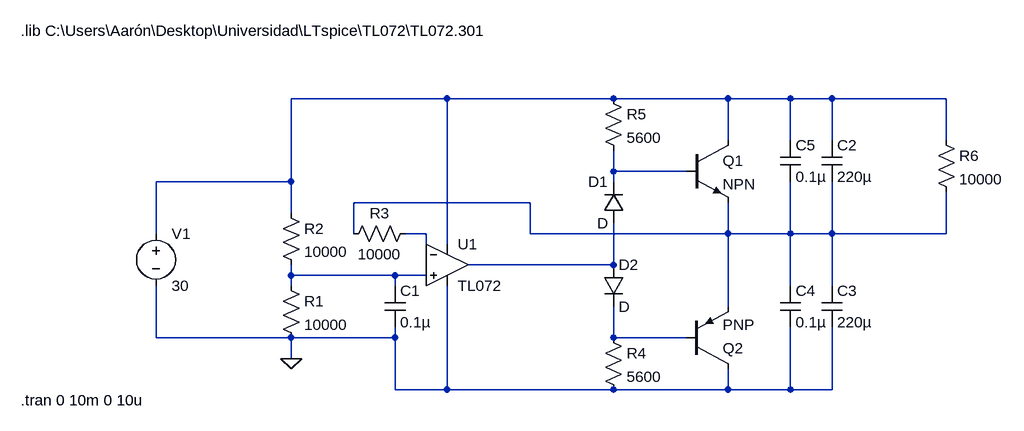
[diagram p0: schematic Symmetric_PowerSupply.asc]
Symmetric_PowerSupply.asc, the LTspice schematic file:
Version 4.1
SHEET 1 1524 680
WIRE 640 128 400 128
WIRE 896 128 640 128
WIRE 1072 128 896 128
WIRE 1168 128 1072 128
WIRE 1232 128 1168 128
WIRE 1408 128 1232 128
WIRE 1072 192 1072 128
WIRE 1168 192 1168 128
WIRE 1232 192 1232 128
WIRE 1408 192 1408 128
WIRE 896 240 896 208
WIRE 1008 240 896 240
WIRE 400 256 400 128
WIRE 400 256 192 256
WIRE 896 256 896 240
WIRE 768 288 496 288
WIRE 400 304 400 256
WIRE 192 336 192 256
WIRE 496 336 496 288
WIRE 608 336 576 336
WIRE 768 336 768 288
WIRE 1072 336 1072 288
WIRE 1072 336 768 336
WIRE 1168 336 1168 256
WIRE 1168 336 1072 336
WIRE 1232 336 1232 256
WIRE 1232 336 1168 336
WIRE 1408 336 1408 272
WIRE 1408 336 1232 336
WIRE 640 352 640 128
WIRE 608 368 608 336
WIRE 896 384 896 320
WIRE 896 384 672 384
WIRE 400 400 400 384
WIRE 560 400 400 400
WIRE 608 400 560 400
WIRE 400 416 400 400
WIRE 560 416 560 400
WIRE 1168 416 1168 336
WIRE 1232 416 1232 336
WIRE 1072 448 1072 336
WIRE 192 496 192 416
WIRE 400 496 192 496
WIRE 560 496 560 480
WIRE 560 496 400 496
WIRE 896 496 896 448
WIRE 1008 496 896 496
WIRE 400 528 400 496
WIRE 560 576 560 496
WIRE 640 576 640 416
WIRE 640 576 560 576
WIRE 896 576 640 576
WIRE 1072 576 1072 544
WIRE 1072 576 896 576
WIRE 1168 576 1168 480
WIRE 1168 576 1072 576
WIRE 1232 576 1232 480
WIRE 1232 576 1168 576
FLAG 400 528 0
SYMBOL OpAmps\\opamp2 640 320 R0
SYMATTR InstName U1
SYMATTR Value TL072
SYMBOL cap 544 416 R0
SYMATTR InstName C1
SYMATTR Value 0.1µ
SYMATTR SpiceLine V=35 Irms=0 Rser=0 Lser=0
SYMBOL res 384 400 R0
SYMATTR InstName R1
SYMATTR Value 10000
SYMBOL res 384 288 R0
SYMATTR InstName R2
SYMATTR Value 10000
SYMBOL voltage 192 320 R0
WINDOW 123 0 0 Left 0
WINDOW 39 0 0 Left 0
SYMATTR InstName V1
SYMATTR Value 30
SYMBOL res 592 320 R90
WINDOW 0 0 56 VBottom 2
WINDOW 3 32 56 VTop 2
SYMATTR InstName R3
SYMATTR Value 10000
SYMBOL diode 912 320 R180
WINDOW 0 24 64 Left 2
WINDOW 3 24 0 Left 2
SYMATTR InstName D1
SYMBOL diode 880 384 R0
SYMATTR InstName D2
SYMBOL res 880 480 R0
SYMATTR InstName R4
SYMATTR Value 5600
SYMBOL res 880 112 R0
SYMATTR InstName R5
SYMATTR Value 5600
SYMBOL npn 1008 192 R0
SYMATTR InstName Q1
SYMBOL pnp 1008 544 M180
SYMATTR InstName Q2
SYMBOL cap 1216 192 R0
SYMATTR InstName C2
SYMATTR Value 220µ
SYMATTR SpiceLine V=50
SYMBOL cap 1216 416 R0
SYMATTR InstName C3
SYMATTR Value 220µ
SYMATTR SpiceLine V=50
SYMBOL cap 1152 416 R0
SYMATTR InstName C4
SYMATTR Value 0.1µ
SYMATTR SpiceLine V=50
SYMBOL cap 1152 192 R0
SYMATTR InstName C5
SYMATTR Value 0.1µ
SYMATTR SpiceLine V=50
SYMBOL res 1392 176 R0
SYMATTR InstName R6
SYMATTR Value 10000
TEXT -16 24 Left 2 !.lib C:\\Users\\Aarón\\Desktop\\Universidad\\LTspice\\TL072\\TL072.301
TEXT -16 592 Left 2 !.tran 0 10m 0 10u

The netlist it stands for:
* Symmetric_PowerSupply.asc
X§U1 N006 N004 N001 0 N005 TL072  ; pins In+ In- V+ V- OUT
C1 N006 0 0.1µ V=35 Irms=0 Rser=0 Lser=0
R1 N006 0 10000
R2 N001 N006 10000
V1 N001 0 30
R3 N004 N003 10000
D1 N005 N002 D
D2 N005 N007 D
R4 N007 0 5600
R5 N001 N002 5600
Q1 N001 N002 N003 0 NPN
Q2 0 N007 N003 0 PNP
C2 N001 N003 220µ V=50
C3 N003 0 220µ V=50
C4 N003 0 0.1µ V=50
C5 N001 N003 0.1µ V=50
R6 N001 N003 10000
.model D D
.lib standard.dio
.model NPN NPN
.model PNP PNP
.lib standard.bjt
.lib C:\Users\Aarón\Desktop\Universidad\LTspice\TL072\TL072.301
.tran 0 10m 0 10u
.backanno
.end